# Altium schematic sheet dIn.SchDoc
size A4
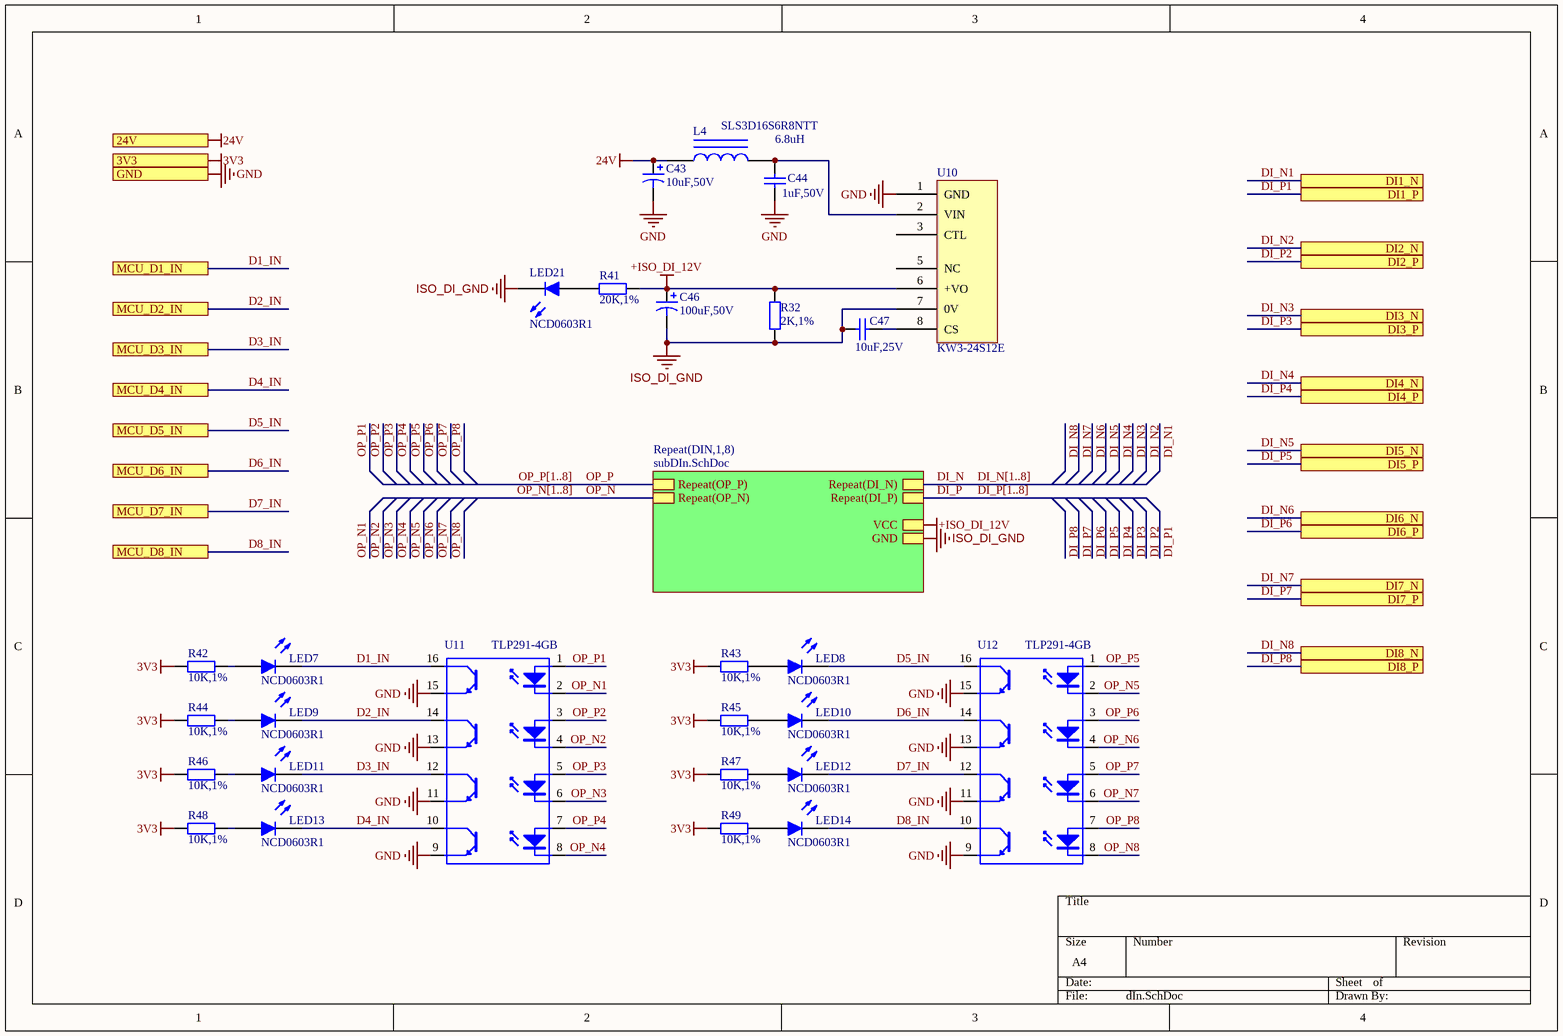
[diagram p0: dIn.SchDoc]

## Parts
C43  10uF,50V  [CAP-TH_BD5.0-P2.00-D0.8-FD]
C44  1uF,50V  [C0603]
C46  100uF,50V  [CAP-TH_BD6.3-P2.50-D1.0-FD]
C47  10uF,25V  [C0805]
L4  SLS3D16S6R8NTT  value 6.8uH  [IND-SMD_L4.0-W4.0_SLS3DXX]
LED7  NCD0603R1  [LED0603-RD]
LED8  NCD0603R1  [LED0603-RD]
LED9  NCD0603R1  [LED0603-RD]
LED10  NCD0603R1  [LED0603-RD]
LED11  NCD0603R1  [LED0603-RD]
LED12  NCD0603R1  [LED0603-RD]
LED13  NCD0603R1  [LED0603-RD]
LED14  NCD0603R1  [LED0603-RD]
LED21  NCD0603R1  [LED0603-RD]
R32  2K,1%  [R0603]
R41  20K,1%  [R0603]
R42  10K,1%  [R0603]
R43  10K,1%  [R0603]
R44  10K,1%  [R0603]
R45  10K,1%  [R0603]
R46  10K,1%  [R0603]
R47  10K,1%  [R0603]
R48  10K,1%  [R0603]
R49  10K,1%  [R0603]
U10  KW3-24S12E  [PWRM-TH_WRA2415S-3WR2]
U11  TLP291-4GB  [SOP-16_L10.3-W4.4-P1.27-LS7.0-BL]
U12  TLP291-4GB  [SOP-16_L10.3-W4.4-P1.27-LS7.0-BL]

## Sub-sheets
Repeat(DIN,1,8) = subDIn.SchDoc: GND, VCC, Repeat(DI_P), Repeat(DI_N), Repeat(OP_P), Repeat(OP_N)

## Ports
3V3, 24V, DI1_N, DI1_P, DI2_N, DI2_P, DI3_N, DI3_P, DI4_N, DI4_P, DI5_N, DI5_P, DI6_N, DI6_P, DI7_N, DI7_P, DI8_N, DI8_P, GND, MCU_D1_IN, MCU_D2_IN, MCU_D3_IN, MCU_D4_IN, MCU_D5_IN, MCU_D6_IN, MCU_D7_IN, MCU_D8_IN

## Nets
3V3: R42.2 R43.2 R44.2 R45.2 R46.2 R47.2 R48.2 R49.2 ; port 3V3
24V: C43.1 L4.1 ; port 24V
+ISO_DI_12V: C46.1 R32.2 R41.2 U10.6(+VO) ; sheet Repeat(DIN,1,8)/VCC
GND: C43.2 C44.1 U10.1(GND) U11.9(E) U11.11(E) U11.13(E) U11.15(E) U12.9(E) U12.11(E) U12.13(E) U12.15(E) ; port GND
ISO_DI_GND: C46.2 C47.1 LED21.1(K) R32.1 U10.7(0V) ; sheet Repeat(DIN,1,8)/GND
D1_IN: LED7.1(K) U11.16(C) ; port MCU_D1_IN
D2_IN: LED9.1(K) U11.14(C) ; port MCU_D2_IN
D3_IN: LED11.1(K) U11.12(C) ; port MCU_D3_IN
D4_IN: LED13.1(K) U11.10(C) ; port MCU_D4_IN
D5_IN: LED8.1(K) U12.16(C) ; port MCU_D5_IN
D6_IN: LED10.1(K) U12.14(C) ; port MCU_D6_IN
D7_IN: LED12.1(K) U12.12(C) ; port MCU_D7_IN
D8_IN: LED14.1(K) U12.10(C) ; port MCU_D8_IN
DI_N: sheet Repeat(DIN,1,8)/Repeat(DI_N)
DI_N1: port DI1_N
DI_N2: port DI2_N
DI_N3: port DI3_N
DI_N4: port DI4_N
DI_N5: port DI5_N
DI_N6: port DI6_N
DI_N7: port DI7_N
DI_N8: port DI8_N
DI_P: sheet Repeat(DIN,1,8)/Repeat(DI_P)
DI_P1: port DI1_P
DI_P2: port DI2_P
DI_P3: port DI3_P
DI_P4: port DI4_P
DI_P5: port DI5_P
DI_P6: port DI6_P
DI_P7: port DI7_P
DI_P8: port DI8_P
OP_N: sheet Repeat(DIN,1,8)/Repeat(OP_N)
OP_N1: U11.2(K)
OP_N2: U11.4(K)
OP_N3: U11.6(K)
OP_N4: U11.8(K)
OP_N5: U12.2(K)
OP_N6: U12.4(K)
OP_N7: U12.6(K)
OP_N8: U12.8(K)
OP_P: sheet Repeat(DIN,1,8)/Repeat(OP_P)
OP_P1: U11.1
OP_P2: U11.3(A)
OP_P3: U11.5(A)
OP_P4: U11.7(A)
OP_P5: U12.1
OP_P6: U12.3(A)
OP_P7: U12.5(A)
OP_P8: U12.7(A)
NetC44_2: C44.2 L4.2 U10.2(VIN)
NetC47_2: C47.2 U10.8(CS)
NetLED7_2: LED7.2(A) R42.1
NetLED8_2: LED8.2(A) R43.1
NetLED9_2: LED9.2(A) R44.1
NetLED10_2: LED10.2(A) R45.1
NetLED11_2: LED11.2(A) R46.1
NetLED12_2: LED12.2(A) R47.1
NetLED13_2: LED13.2(A) R48.1
NetLED14_2: LED14.2(A) R49.1
NetLED21_2: LED21.2(A) R41.1

Not connected (* = marked no-connect by the designer): U10 3(CTL) 5(NC)

## Buses and harness runs
bus DI_N[1..8]
bus DI_P[1..8]
bus OP_N[1..8]
bus OP_P[1..8]

## Library data of the parts
C43 = 有极电容: Value: 100UF
C44 C47 = 无极电容: Value: 104, 16V; Type: 贴片电容
C46 = 有极电容: Value: 100UF
L4 = Inductor Iron: Magnetic-Core Inductor; Published: 24-Mar-1999; LatestRevisionDate: 17-Jul-2002; LatestRevisionNote: Re-released for DXP Platform.; PackageReference: AXIAL-0.9; Publisher: Altium Limited; PackageDescription: Axial Device, Thru-Hole; 2 Leads; 0.9 in Pin Spacing
LED7-LED14 LED21 = LED0603: Typical INFRARED GaAs LED
R32 R41 = 电阻: Value: 3.3K, 10%; Type: 贴片电阻
R42-R49 = 电阻: Value: 5.1K, 1%; Type: 贴片电阻
U10 = KW3-24S12E: 3W，宽电压输入，隔离稳压输出 DC/DC 模块电源
U11 U12 = TLP624-4: name: 4路光耦